# EAGLE design HB-UNI-Sen-TEMP-DS18B20 (EAGLE 9.4.2)
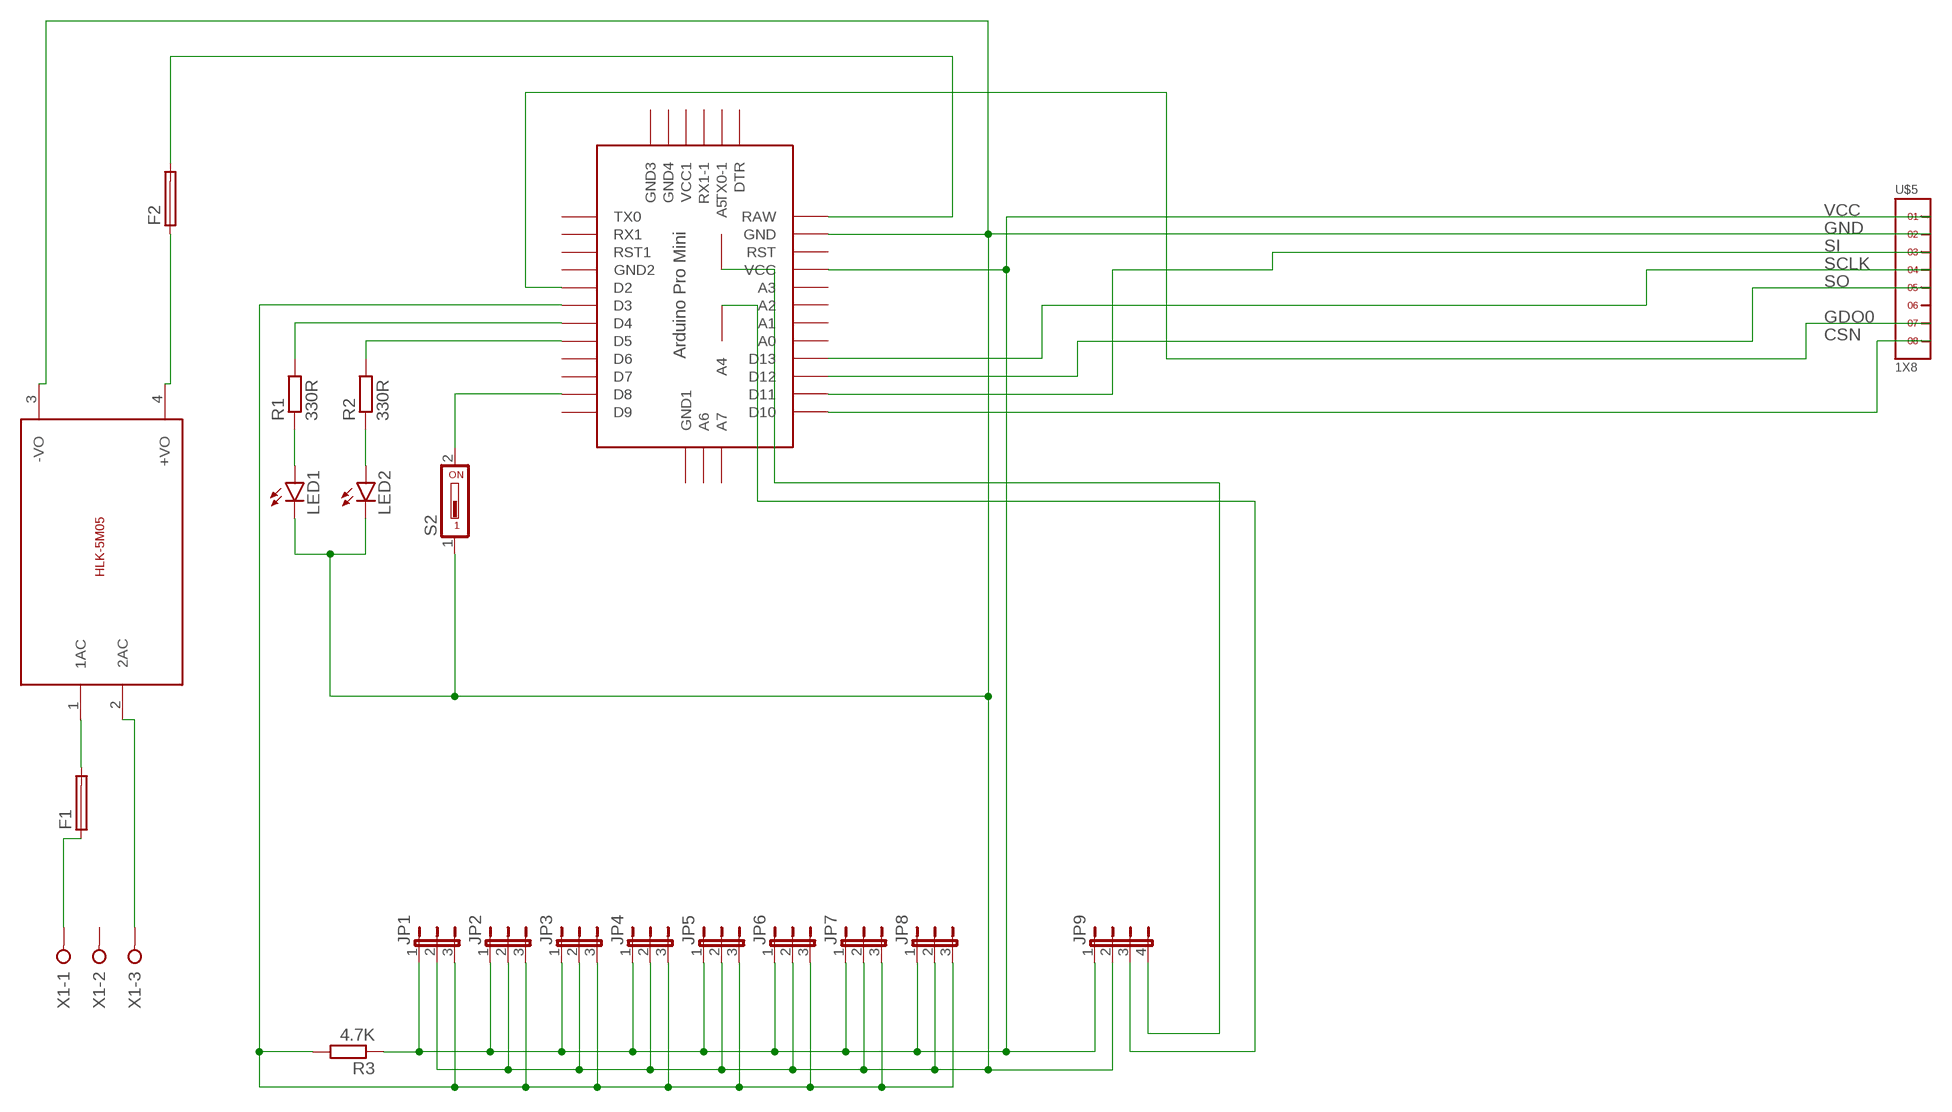
[diagram p0: schematic, sheet 1]

## Parts
F1  GSH15  [GSH15]
F2  GSH15  [GSH15]
JP1  JP2W  [JP2W]
JP2  JP2W  [JP2W]
JP3  JP2W  [JP2W]
JP4  JP2W  [JP2W]
JP5  JP2W  [JP2W]
JP6  JP2W  [JP2W]
JP7  JP2W  [JP2W]
JP8  JP2W  [JP2W]
JP9  JP4E  [JP4]
LED1  LED5MM  [LED5MM]
LED2  LED5MM  [LED5MM]
R1  330R  R-EU_0207/10  [0207/10]
R2  330R  R-EU_0207/10  [0207/10]
R3  4.7K  R-EU_0207/10  [0207/10]
S2  DS01  [DS-01]
U$1  ABK-PRO-MINI  [ABK-PRO-MINI]
U$3  5VDC/5W  HLK-5M05  [HLK-5M05]
U$5  1X8  [1X8]
X1  W237-3E  [W237-3E]

## Nets
CSN: U$1.D10 U$5.8
GDO0: U$1.D2 U$5.7
GND: JP1.2 JP2.2 JP3.2 JP4.2 JP5.2 JP6.2 JP7.2 JP8.2 JP9.2 LED1.K(C) LED2.K(C) S2.1 U$1.GND U$3.3(-VO) U$5.2
N$3: F1.1 X1.1
N$5: F2.1 U$3.4(+VO)
N$6: F1.2 U$3.1(1AC)
N$7: U$3.2(2AC) X1.3
N$8: JP1.3 JP2.3 JP3.3 JP4.3 JP5.3 JP6.3 JP7.3 JP8.3 R3.2 U$1.D3
N$9: LED1.A R1.1
N$10: LED2.A R2.1
N$11: R1.2 U$1.D4
N$12: R2.2 U$1.D5
N$13: S2.2 U$1.D8
RAW: F2.2 U$1.RAW
SCL: JP9.4 U$1.A5
SCLK: U$1.D13 U$5.4
SDA: JP9.3 U$1.A4
SI: U$1.D11 U$5.3
SO: U$1.D12 U$5.5
VCC: JP1.1 JP2.1 JP3.1 JP4.1 JP5.1 JP6.1 JP7.1 JP8.1 JP9.1 R3.1 U$1.VCC U$5.1
Unconnected: U$1.A0 U$1.A1 U$1.A2 U$1.A3 U$1.A6 U$1.A7 U$1.D6 U$1.D7 U$1.D9 U$1.DTR U$1.GND1(GND2) U$1.GND2(GND3) U$1.GND3(GND4) U$1.GND4(GND1) U$1.RST U$1.RST1 U$1.RX1 U$1.RX1-1 U$1.TX0 U$1.TX0-1 U$1.VCC1 U$5.6 X1.2

## Library data of the parts
F1 F2 = fuse:GSH15: FUSE HOLDER grid 15mm, 19649 Wickmann; MPN: 64900001039; OC_FARNELL: 1271673; OC_NEWARK: 02P0318
JP1-JP8 = jumper:JP2W: JUMPER
JP9 = jumper:JP4E: JUMPER
LED1 LED2 = led:LED: LED OSRAM: - CHIPLED LG R971, LG N971, LY N971, LG Q971, LY Q971, LO R971, LY R971 LH N974, LH R974 LS Q976, LO Q976, LY Q976 LO Q996 - Hyper CHIPLED LW Q18S LB Q993, LB Q99A, LB R99A - SideLED LS A670, LO A670, LY A670, LG A670, LP A670 LB A673, LV A673, LT A673, LW A673 LH A674 LY A675 LS A676, LA A676, LO A676, LY A676, LW A676 LS A679, LY A679, LG A679 - Hyper Micro SIDELED® LS Y876, LA Y876, LO Y876, LY Y876 LT Y87S - SmartLED LW L88C, LW L88S LB L89C, LB L89S, LG L890 LS L89K, LO L89K, LY L89K LS L896, LA L896, LO L896, LY L896 - TOPLED LS T670, LO T670, LY T670, LG T670, LP T670 LSG T670, LSP T670, LSY T670, LOP T670, LYG T670 LG T671, LOG T671, LSG T671 LB T673, LV T673, LT T673, LW T673 LH T674 LS T676, LA T676, LO T676, LY T676, LB T676, LH T676, LSB T676, LW T676 LB T67C, LV T67C, LT T67C, LS T67K, LO T67K, LY T67K, LW E67C LS E67B, LA E67B, LO E67B, LY E67B, LB E67C, LV E67C, LT E67C LW T67C LS T679, LY T679, LG T679 LS T770, LO T770, LY T770, LG T770, LP T770 LB T773, LV T773, LT T773, LW T773 LH T774 LS E675, LA E675, LY E675, LS T675 LS T776, LA T776, LO T776, LY T776, LB T776 LHGB T686 LT T68C, LB T68C - Hyper Mini TOPLED® LB M676 - Mini TOPLED Santana® LG M470 LS M47K, LO M47K, LY M47K Source: http://www.osram.convergy.de LUXEON: - LUMILED® LXK2-PW12-R00, LXK2-PW12-S00, LXK2-PW14-U00, LXK2-PW14-V00 LXK2-PM12-R00, LXK2-PM12-S00, LXK2-PM14-U00 LXK2-PE12-Q00, LXK2-PE12-R00, LXK2-PE12-S00, LXK2-PE14-T00, LXK2-PE14-U00 LXK2-PB12-K00, LXK2-PB12-L00, LXK2-PB12-M00, LXK2-PB14-N00, LXK2-PB14-P00, LXK2-PB14-Q00 LXK2-PR12-L00, LXK2-PR12-M00, LXK2-PR14-Q00, LXK2-PR14-R00 LXK2-PD12-Q00, LXK2-PD12-R00, LXK2-PD12-S00 LXK2-PH12-R00, LXK2-PH12-S00 LXK2-PL12-P00, LXK2-PL12-Q00, LXK2-PL12-R00 Source: www.luxeon.com KINGBRIGHT: KA-3528ASYC Source: www.kingbright.com
R1-R3 = resistor:R-EU_: RESISTOR, European symbol
S2 = switch-dil:DS01: DIL/CODE SWITCH; OC_FARNELL: unknown; OC_NEWARK: unknown
U$1 = Arduino-clone:ABK-PRO-MINI: ABK Pro-Mini Arduino Clone
U$3 = HLK-5M05:HLK-5M05: HLK-5M05 is an 5Volt/5W smps developed by HI-LINK; SIZE: 23x38(mm)
U$5 = headers(2mm):1X8
X1 = con-wago-508:W237-3E: WAGO SREW CLAMP; OC_FARNELL: unknown; OC_NEWARK: unknown

## Board
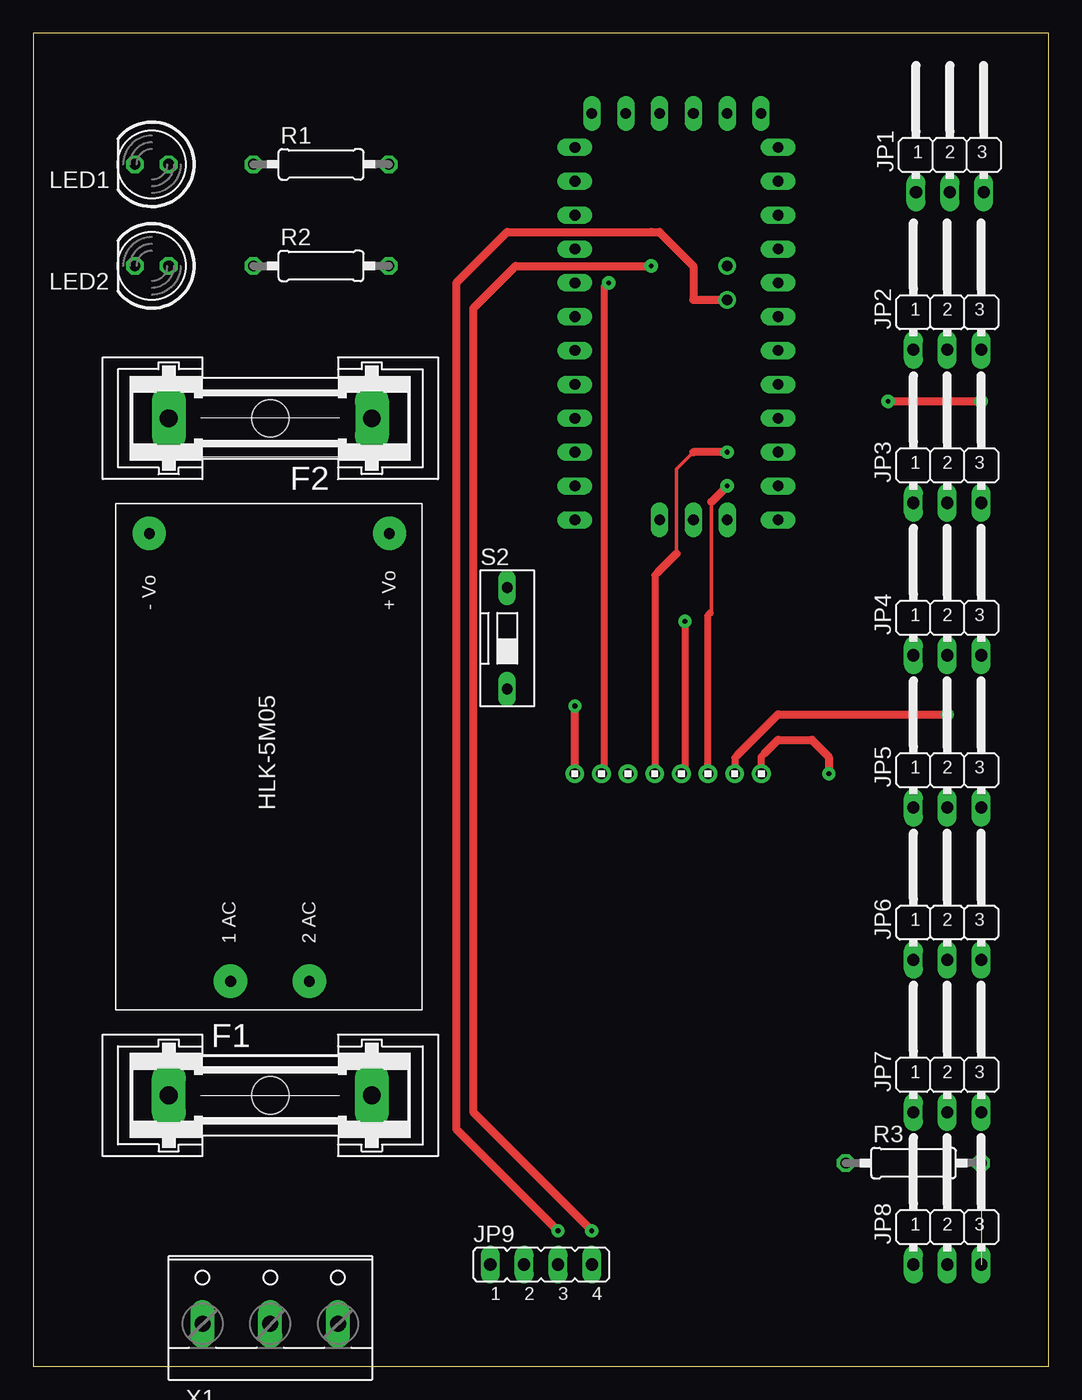
[diagram p1: board, top side]
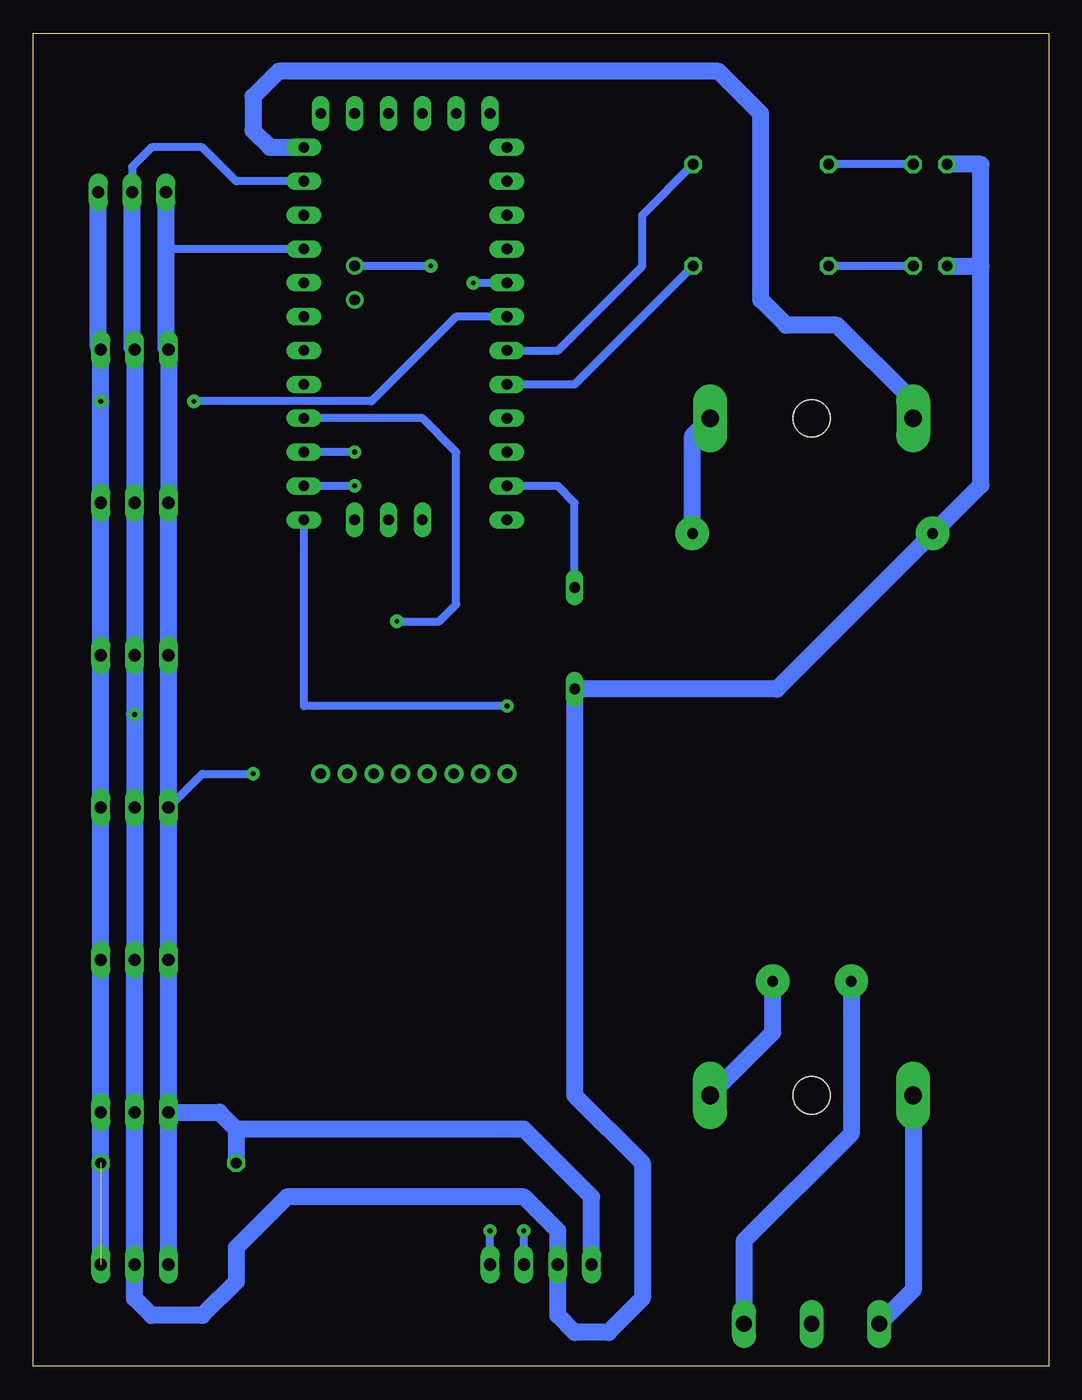
[diagram p2: board, bottom side, seen from below]

Size 76.18 x 100 mm. Coordinates in mm from the lower left corner, seen from the top.
Outline: 0,0 76.18,0 76.18,100 0,100 0,0
Copper layers (1*16): Top 0.035mm / dielectric 1.5mm / Bottom 0.035mm
Design rules "default": minimum track width 6mil, minimum drill 0.35mm, track to track 6mil, track to pad 6mil, pad to pad 6mil, via to via 6mil, smd to smd 6mil, copper to edge 40mil, drill to drill 6mil, minimum pad ring 10mil, minimum via ring 8mil, stop-mask expansion 4mil, vias tented up to drill 0mil, thermal gap 10mil

### Footprints (pad centres in the part's own frame; a part is rotated, then mirrored left to right if it is on the bottom)
GSH15 = drill 1.321 pad 2.54 long: 1 -7.62,0; 2 7.62,0 | hole 2.794: 0,0
JP2W = drill 0.914 long: 1 -2.54,-1.27; 2 0,-1.27; 3 2.54,-1.27
JP4 = drill 0.914 long: 1 -3.81,0; 2 -1.27,0; 3 1.27,0; 4 3.81,0
LED5MM = drill 0.813 octagon: A -1.27,0; K 1.27,0
0207/10 = drill 0.813 octagon: 1 -5.08,0; 2 5.08,0
DS-01 = drill 0.813 long: 1 0,-3.81; 2 0,3.81
ABK-PRO-MINI = drill 0.8 long: A0 10.16,-3.81; A1 10.16,-6.35; A2 10.16,-8.89; A3 10.16,-11.43; A6 3.81,-21.59; A7 6.35,-21.59; D2 -5.08,-3.81; D3 -5.08,-6.35; D4 -5.08,-8.89; D5 -5.08,-11.43; D6 -5.08,-13.97; D7 -5.08,-16.51; D8 -5.08,-19.05; D9 -5.08,-21.59; D10 10.16,-21.59; D11 10.16,-19.05; D12 10.16,-16.51; D13 10.16,-13.97; DTR 8.89,8.89; GND 10.16,3.81; GND1 -5.08,-1.27; GND2 -3.81,8.89; GND3 -1.27,8.89; GND4 1.27,-21.59; RAW 10.16,6.35; RST 10.16,1.27; RST1 -5.08,1.27; RX1 -5.08,3.81; RX1-1 3.81,8.89; TX0 -5.08,6.35; TX0-1 6.35,8.89; VCC 10.16,-1.27; VCC1 1.27,8.89 | drill 0.8: A4 6.35,-5.08; A5 6.35,-2.54
HLK-5M05 = drill 0.8 square: 1 -16.85,-2.93; 2 -16.85,2.97; 3 16.75,9.07; 4 16.75,-8.93
1X8 = drill 0.8 pad 1.422: 1 -7,0; 2 -5,0; 3 -3,0; 4 -1,0; 5 1,0; 6 3,0; 7 5,0; 8 7,0
W237-3E = drill 1.194 long: 1 -5.08,-0.635; 2 0,-0.635; 3 5.08,-0.635

### Placement (x,y rotation side)
F1  17.78,20.32 0 top
F2  17.78,71.12 180 top
JP1  68.77,89.34 0 top
JP2  68.58,77.53 0 top
JP3  68.58,66.04 0 top
JP4  68.58,54.61 0 top
JP5  68.58,43.18 0 top
JP6  68.58,31.75 0 top
JP7  68.58,20.32 0 top
JP8  68.58,8.89 0 top
JP9  38.1,7.62 0 top
LED1  8.89,90.17 180 top
LED2  8.89,82.55 180 top
R1  21.59,90.17 0 top
R2  21.59,82.55 0 top
R3  66.04,15.24 0 top
S2  35.56,54.61 0 top
U$1  45.72,85.09 0 top
U$3  17.78,45.72 90 top
U$5  47.62,44.45 180 top
X1  17.78,3.81 0 top

### Tracks (layer width: path | path; a pad name or v marks a point on that pad's centre or on a via)
CSN  (via drill 0.35 pad 1)
  Top 0.508: U$5.8 40.64,44.47 v40.64,49.53
  Top 0.61: 40.64,44.38 v40.64,49.53
  Bottom 0.61: v40.64,49.53 55.88,49.53 U$1.D10
GDO0  (via drill 0.35 pad 1)
  Top 0.508: U$5.7 42.87,44.7 42.87,80.97
  Top 0.61: 42.87,80.97 v43.18,81.28
  Bottom 0.61: v43.18,81.28 U$1.D2
GND  (via drill 0.35 pad 1)
  Top 0.508: 52.87,45.88 52.62,45.64 U$5.2
  Top 0.61: 52.87,45.88 55.88,48.9 v68.58,48.9
  Bottom 0.61: U$1.GND 60.96,88.9 63.5,91.44 67.31,91.44 68.77,89.98 JP1.2
  Bottom 1.27: JP1.2 68.77,76.45 JP2.2 JP3.2 JP4.2 v68.58,48.9 JP5.2 JP6.2 JP7.2 JP8.2 68.58,5.08 67.31,3.81 63.5,3.81 60.96,6.35 60.96,8.89 57.15,12.7 39.37,12.7 36.83,10.16 JP9.2 36.83,3.81 35.56,2.54 33.02,2.54 30.48,5.08 30.48,15.24 35.56,20.32 S2.1 20.38,50.8 U$3.3 5.08,66.1 5.08,82.55 | 5.08,82.55 5.08,90.17 LED1.K | LED2.K 5.08,82.55
N$3
  Bottom 1.27: F1.1 10.16,5.71 X1.1
N$5
  Bottom 1.27: U$3.4 26.71,69.81 F2.1
N$6
  Bottom 1.27: U$3.1 20.71,25.01 F1.2
N$7
  Bottom 1.27: X1.3 22.86,9.4 14.81,17.45 U$3.2
N$8  (via drill 0.35 pad 1)  (1 unrouted)
  Top 0.61: v64.14,72.39 v71.12,72.39
  Bottom 0.61: U$1.D3 44.45,78.74 50.8,72.39 v64.14,72.39
  Bottom 1.27: JP8.3 JP7.3 JP6.3 JP5.3 JP4.3 JP3.3 v71.12,72.39 JP2.3 71.31,76.45 JP1.3
N$9
  Bottom 0.61: LED1.A R1.1
N$10
  Bottom 0.61: LED2.A R2.1
N$11
  Bottom 0.61: U$1.D4 36.83,76.2 30.48,82.55 30.48,86.36 R1.2
N$12
  Bottom 0.61: R2.2 35.56,73.66 U$1.D5
N$13
  Bottom 0.61: S2.2 35.56,64.77 36.83,66.04 U$1.D8
N$21  (via drill 0.35 pad 2.5)
  other vias: 14.8,28.89
N$22  (via drill 0.35 pad 2.5)
  other vias: 20.7,28.89
N$23  (via drill 0.35 pad 2.5)
  other vias: 8.7,62.48
N$24  (via drill 0.35 pad 2.5)
  other vias: 26.73,62.48
RAW
  Bottom 1.27: F2.2 10.16,72.39 15.88,78.11 19.68,78.11 21.59,80.01 21.59,93.98 24.77,97.16 57.78,97.16 59.69,95.25 59.69,92.71 58.42,91.44 U$1.RAW
SCL  (via drill 0.35 pad 1)
  Top 0.61: v41.91,10.16 33.02,19.05 33.02,79.38 36.2,82.55 v46.35,82.55
  Bottom 0.61: JP9.4 v41.91,10.16 | v46.35,82.55 U$1.A5
SCLK  (via drill 0.35 pad 1)
  Top 0.508: v48.9,55.88 48.9,44.72 U$5.4
  Top 0.61: 48.87,55.85 v48.9,55.88
  Bottom 0.61: v48.9,55.88 45.72,55.88 44.45,57.15 44.45,68.58 46.99,71.12 U$1.D13
SDA  (via drill 0.35 pad 1)
  Top 0.61: v39.37,10.16 31.75,17.78 31.75,81.28 35.56,85.09 46.35,85.09 46.99,85.09 49.53,82.55 49.53,80.01 U$1.A4
  Bottom 0.61: JP9.3 v39.37,10.16
SI  (via drill 0.35 pad 1)
  Top 0.254: 50.8,56.52 50.87,56.59 50.87,64.84
  Top 0.508: U$5.3 50.62,56.34 50.8,56.52
  Top 0.61: 50.87,64.84 v52.07,66.04
  Bottom 0.61: v52.07,66.04 U$1.D11
SO  (via drill 0.35 pad 1)
  Top 0.254: 49.53,68.58 48.26,67.31 48.26,60.96
  Top 0.508: 46.87,59.57 46.62,59.33 U$5.5
  Top 0.61: 48.26,60.96 46.87,59.57 | v52.07,68.58 49.53,68.58
  Bottom 0.61: v52.07,68.58 U$1.D12
VCC  (via drill 0.35 pad 1)
  Top 0.508: U$5.1 54.62,45.73 54.87,45.98
  Top 0.61: 54.87,45.98 55.88,46.99 58.42,46.99 59.69,45.72 v59.69,44.45
  Bottom 0.61: U$1.VCC 66.23,83.82 | JP5.1 63.5,44.45 v59.69,44.45
  Bottom 1.27: JP8.1 JP7.1 | JP7.1 JP6.1 JP5.1 JP4.1 JP3.1 66.04,76.2 | JP2.1 66.04,76.2 | JP1.1 66.23,83.82 66.23,76.39 66.04,76.2 | JP9.1 34.29,12.7 39.37,17.78 60.96,17.78 | JP7.1 62.23,19.05 60.96,17.78 | 60.96,17.78 R3.1